# EAGLE schematic CANSniftAndShift (EAGLE 6.6.0)

## Sheet 1 of 3
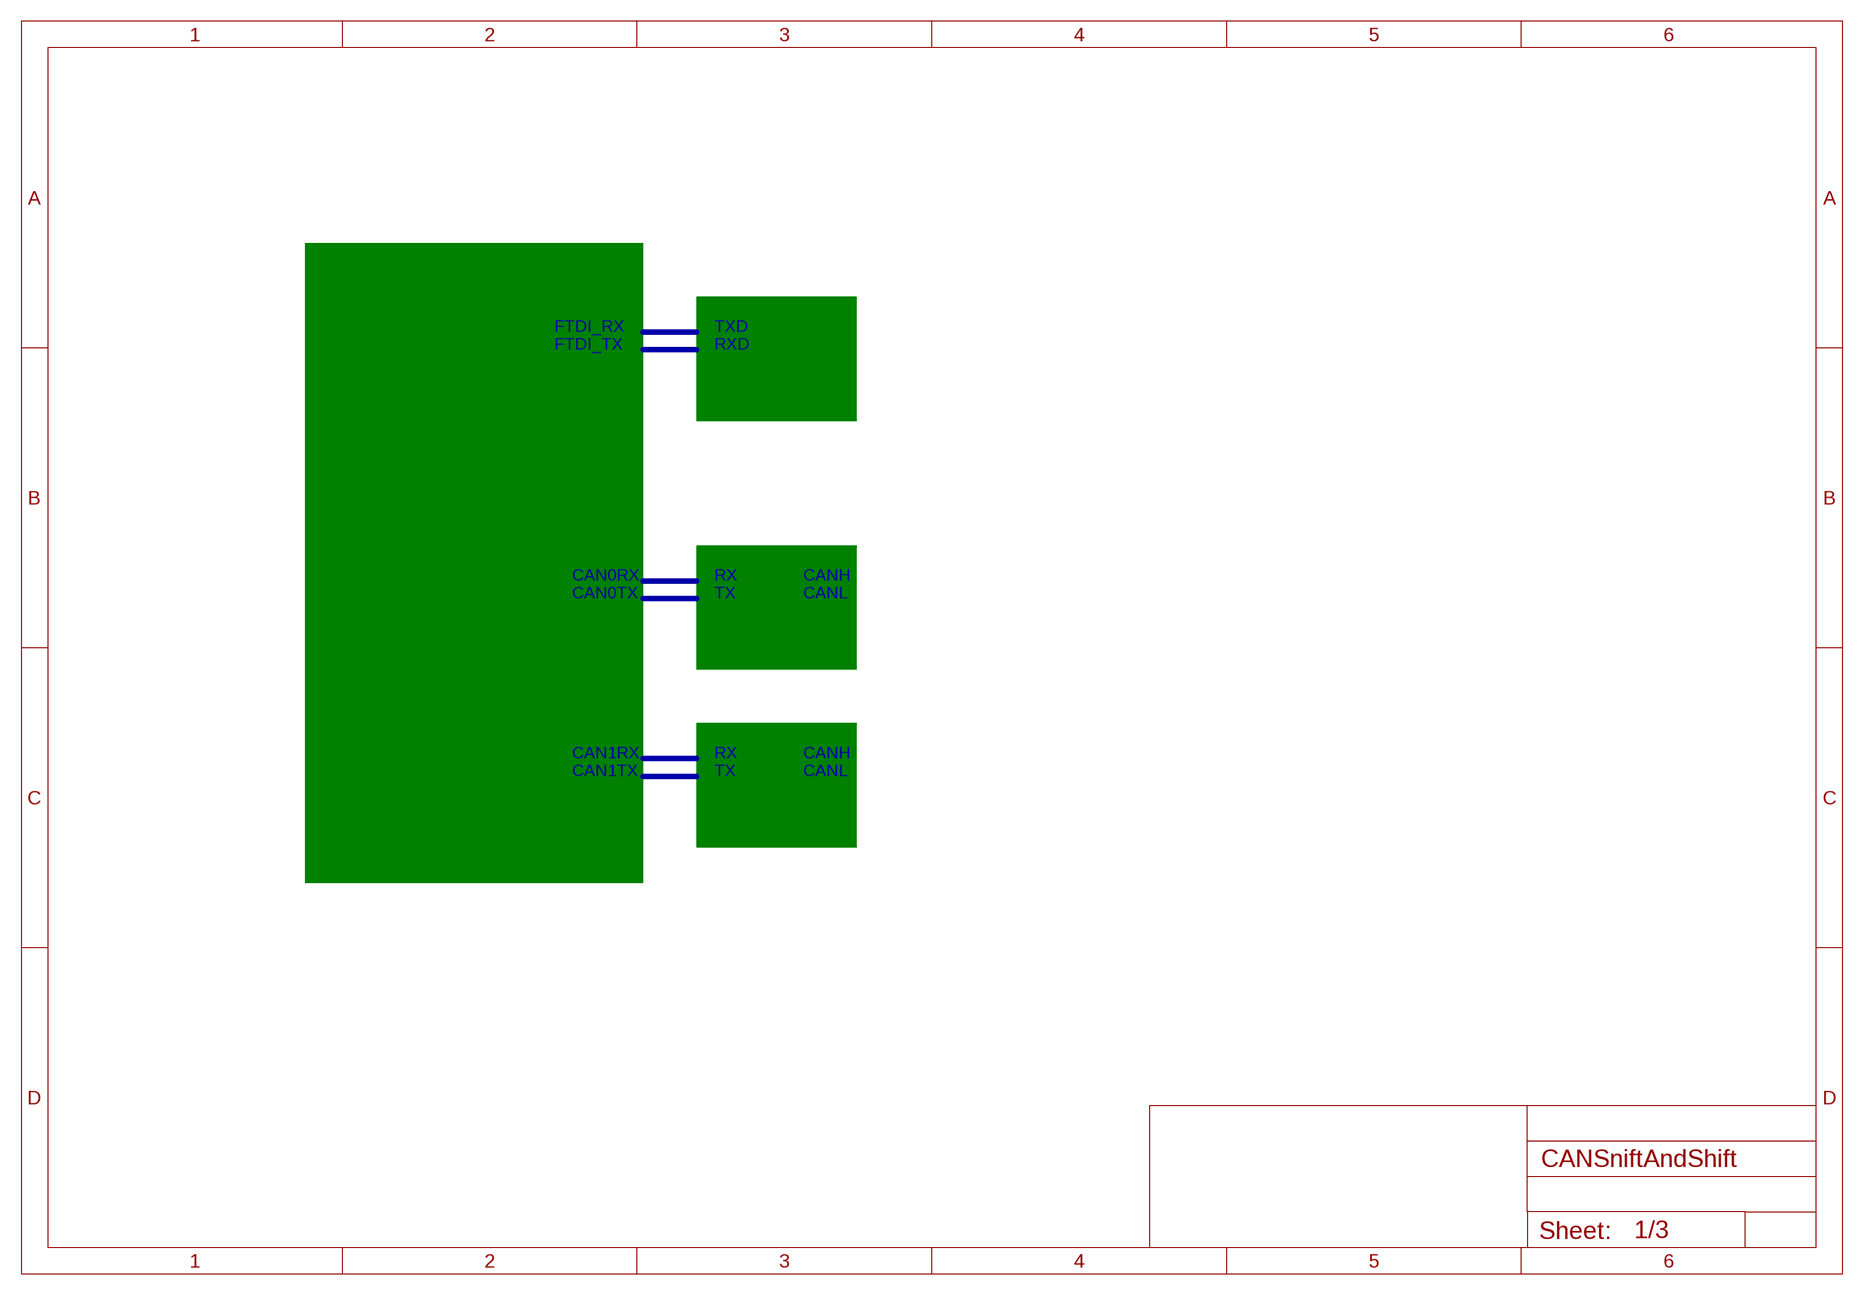
[diagram p0: schematic, sheet 1]

### Buses
B$3
B$4
B$5
B$6
B$1
B$2

### Notes on the sheet
- FTDI_RX | TXD
- FTDI_TX | RXD
- FTDI
- CAN0RX | RX | CANH
- CAN0TX | TX | CANL
- CAN1
- CAN1RX | RX | CANH
- CAN1TX | TX | CANL
- CAN0
- CPU

## Sheet 2 of 3
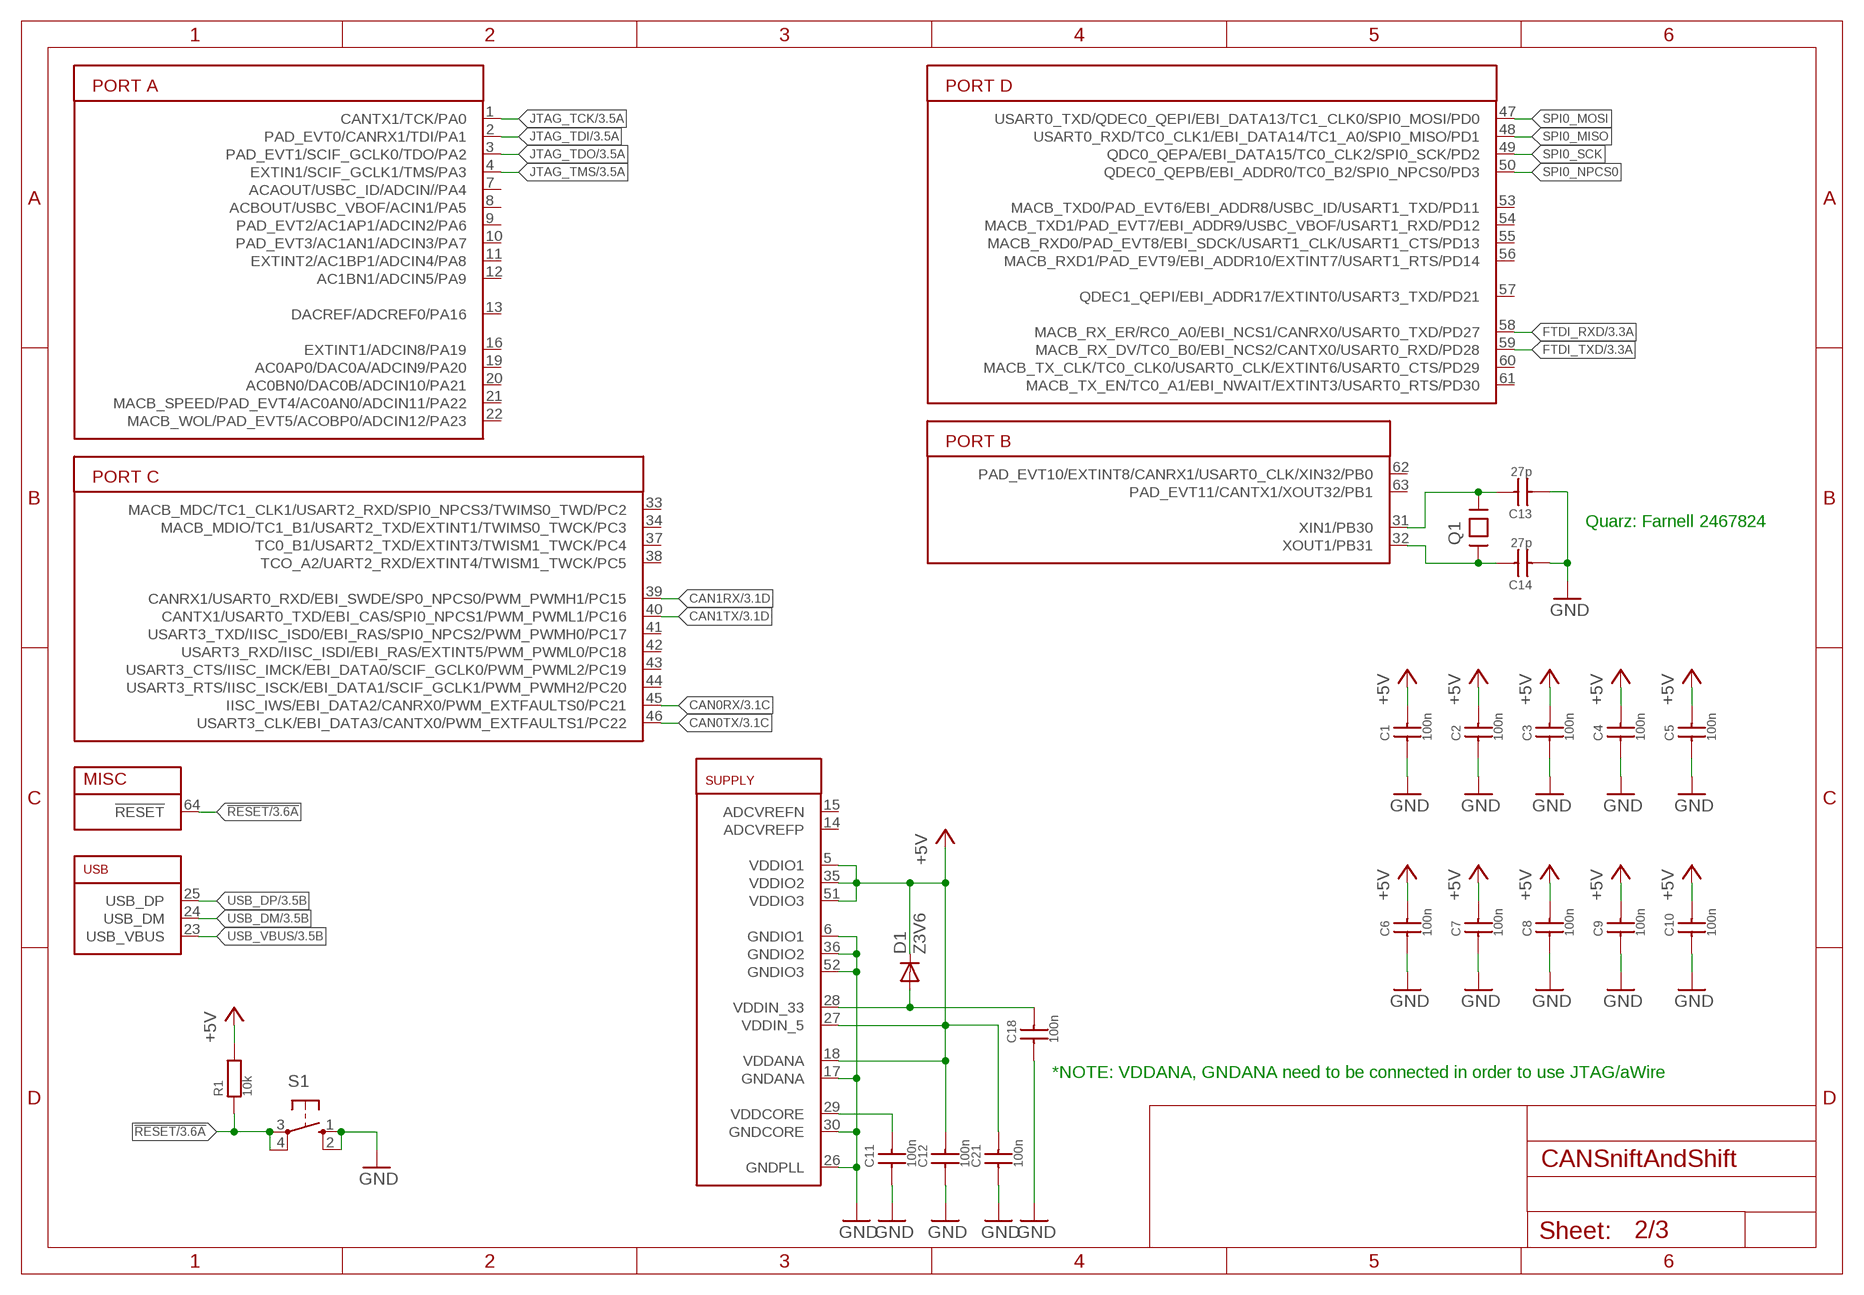
[diagram p1: schematic, sheet 2]

### Parts
C1  100n  C_SMD0603  [C0603]
C2  100n  C_SMD0603  [C0603]
C3  100n  C_SMD0603  [C0603]
C4  100n  C_SMD0603  [C0603]
C5  100n  C_SMD0603  [C0603]
C6  100n  C_SMD0603  [C0603]
C7  100n  C_SMD0603  [C0603]
C8  100n  C_SMD0603  [C0603]
C9  100n  C_SMD0603  [C0603]
C10  100n  C_SMD0603  [C0603]
C11  100n  C_SMD0603  [C0603]
C12  100n  C_SMD0603  [C0603]
C13  27p  C_SMD0603  [C0603]
C14  27p  C_SMD0603  [C0603]
C18  100n  C_SMD0603  [C0603]
C21  100n  C_SMD0603  [C0603]
D1  Z3V6  BZG03C15TR3  [DO214A]
IC1  AT32UC3C264C0.5MM  [TQFP64-0.5MM]
Q1  16MHz  CRYSTAL-ABRACON-ABM7-SMD  [CRYSTAL-ABRACON-ABM7-SMD]
R1  10k  R0603  [R0603]
S1  10-XX  [B3F-10XX]

### Nets
!RESET: IC1.64(!RESET) R1.1 S1.3(P) S1.4(P1) ; also sheet 3
+5V: C1.2 C2.2 C3.2 C4.2 C5.2 C6.2 C7.2 C8.2 C9.2 C10.2 C12.2 C21.2 D1.C IC1.5(VDDIO1) IC1.18(VDDANA) IC1.27(VDDIN_5) IC1.35(VDDIO2) IC1.51(VDDIO3) R1.2 ; also sheet 3
CAN0RX: IC1.45(IISC_IWS/EBI_DATA2/CANRX0/PWM_EXTFAULTS0/PC21) ; also sheet 3
CAN0TX: IC1.46(USART3_CLK/EBI_DATA3/CANTX0/PWM_EXTFAULTS1/PC22) ; also sheet 3
CAN1RX: IC1.39(CANRX1/USART0_RXD/EBI_SWDE/SP0_NPCS0/PWM_PWMH1/PC15) ; also sheet 3
CAN1TX: IC1.40(CANTX1/USART0_TXD/EBI_CAS/SPI0_NPCS1/PWM_PWML1/PC16) ; also sheet 3
FTDI_RXD: IC1.58(MACB_RX_ER/RC0_A0/EBI_NCS1/CANRX0/USART0_TXD/PD27) ; also sheet 3
FTDI_TXD: IC1.59(MACB_RX_DV/TC0_B0/EBI_NCS2/CANTX0/USART0_RXD/PD28) ; also sheet 3
GND: C1.1 C2.1 C3.1 C4.1 C5.1 C6.1 C7.1 C8.1 C9.1 C10.1 C11.1 C12.1 C13.1 C14.1 C18.1 C21.1 IC1.6(GNDIO1) IC1.17(GNDANA) IC1.26(GNDPLL) IC1.30(GNDCORE) IC1.36(GNDIO2) IC1.52(GNDIO3) S1.1(S) S1.2(S1) ; also sheet 3
JTAG_TCK: IC1.1(CANTX1/TCK/PA0) ; also sheet 3
JTAG_TDI: IC1.2(PAD_EVT0/CANRX1/TDI/PA1) ; also sheet 3
JTAG_TDO: IC1.3(PAD_EVT1/SCIF_GCLK0/TDO/PA2) ; also sheet 3
JTAG_TMS: IC1.4(EXTIN1/SCIF_GCLK1/TMS/PA3) ; also sheet 3
N$2: C11.2 IC1.29(VDDCORE)
N$3: C13.2 IC1.31(XIN1/PB30) Q1.P$2
N$4: C14.2 IC1.32(XOUT1/PB31) Q1.P$1
N$8: C18.2 D1.A IC1.28(VDDIN_33)
SPI0_MISO: IC1.48(USART0_RXD/TC0_CLK1/EBI_DATA14/TC1_A0/SPI0_MISO/PD1)
SPI0_MOSI: IC1.47(USART0_TXD/QDEC0_QEPI/EBI_DATA13/TC1_CLK0/SPI0_MOSI/PD0)
SPI0_NPCS0: IC1.50(QDEC0_QEPB/EBI_ADDR0/TC0_B2/SPI0_NPCS0/PD3)
SPI0_SCK: IC1.49(QDC0_QEPA/EBI_DATA15/TC0_CLK2/SPI0_SCK/PD2)
USB_DM: IC1.24(USB_DM) ; also sheet 3
USB_DP: IC1.25(USB_DP) ; also sheet 3
USB_VBUS: IC1.23(USB_VBUS) ; also sheet 3
Unconnected: IC1.7(ACAOUT/USBC_ID/ADCIN//PA4) IC1.8(ACBOUT/USBC_VBOF/ACIN1/PA5) IC1.9(PAD_EVT2/AC1AP1/ADCIN2/PA6) IC1.10(PAD_EVT3/AC1AN1/ADCIN3/PA7) IC1.11(EXTINT2/AC1BP1/ADCIN4/PA8) IC1.12(AC1BN1/ADCIN5/PA9) IC1.13(DACREF/ADCREF0/PA16) IC1.14(ADCVREFP) IC1.15(ADCVREFN) IC1.16(EXTINT1/ADCIN8/PA19) IC1.19(AC0AP0/DAC0A/ADCIN9/PA20) IC1.20(AC0BN0/DAC0B/ADCIN10/PA21) IC1.21(MACB_SPEED/PAD_EVT4/AC0AN0/ADCIN11/PA22) IC1.22(MACB_WOL/PAD_EVT5/ACOBP0/ADCIN12/PA23) IC1.33(MACB_MDC/TC1_CLK1/USART2_RXD/SPI0_NPCS3/TWIMS0_TWD/PC2) IC1.34(MACB_MDIO/TC1_B1/USART2_TXD/EXTINT1/TWIMS0_TWCK/PC3) IC1.37(TC0_B1/USART2_TXD/EXTINT3/TWISM1_TWCK/PC4) IC1.38(TCO_A2/UART2_RXD/EXTINT4/TWISM1_TWCK/PC5) IC1.41(USART3_TXD/IISC_ISD0/EBI_RAS/SPI0_NPCS2/PWM_PWMH0/PC17) IC1.42(USART3_RXD/IISC_ISDI/EBI_RAS/EXTINT5/PWM_PWML0/PC18) IC1.43(USART3_CTS/IISC_IMCK/EBI_DATA0/SCIF_GCLK0/PWM_PWML2/PC19) IC1.44(USART3_RTS/IISC_ISCK/EBI_DATA1/SCIF_GCLK1/PWM_PWMH2/PC20) IC1.53(MACB_TXD0/PAD_EVT6/EBI_ADDR8/USBC_ID/USART1_TXD/PD11) IC1.54(MACB_TXD1/PAD_EVT7/EBI_ADDR9/USBC_VBOF/USART1_RXD/PD12) IC1.55(MACB_RXD0/PAD_EVT8/EBI_SDCK/USART1_CLK/USART1_CTS/PD13) IC1.56(MACB_RXD1/PAD_EVT9/EBI_ADDR10/EXTINT7/USART1_RTS/PD14) IC1.57(QDEC1_QEPI/EBI_ADDR17/EXTINT0/USART3_TXD/PD21) IC1.60(MACB_TX_CLK/TC0_CLK0/USART0_CLK/EXTINT6/USART0_CTS/PD29) IC1.61(MACB_TX_EN/TC0_A1/EBI_NWAIT/EXTINT3/USART0_RTS/PD30) IC1.62(PAD_EVT10/EXTINT8/CANRX1/USART0_CLK/XIN32/PB0) IC1.63(PAD_EVT11/CANTX1/XOUT32/PB1)

### Notes on the sheet
- Quarz: Farnell 2467824
- *NOTE: VDDANA, GNDANA need to be connected in order to use JTAG/aWire

## Sheet 3 of 3
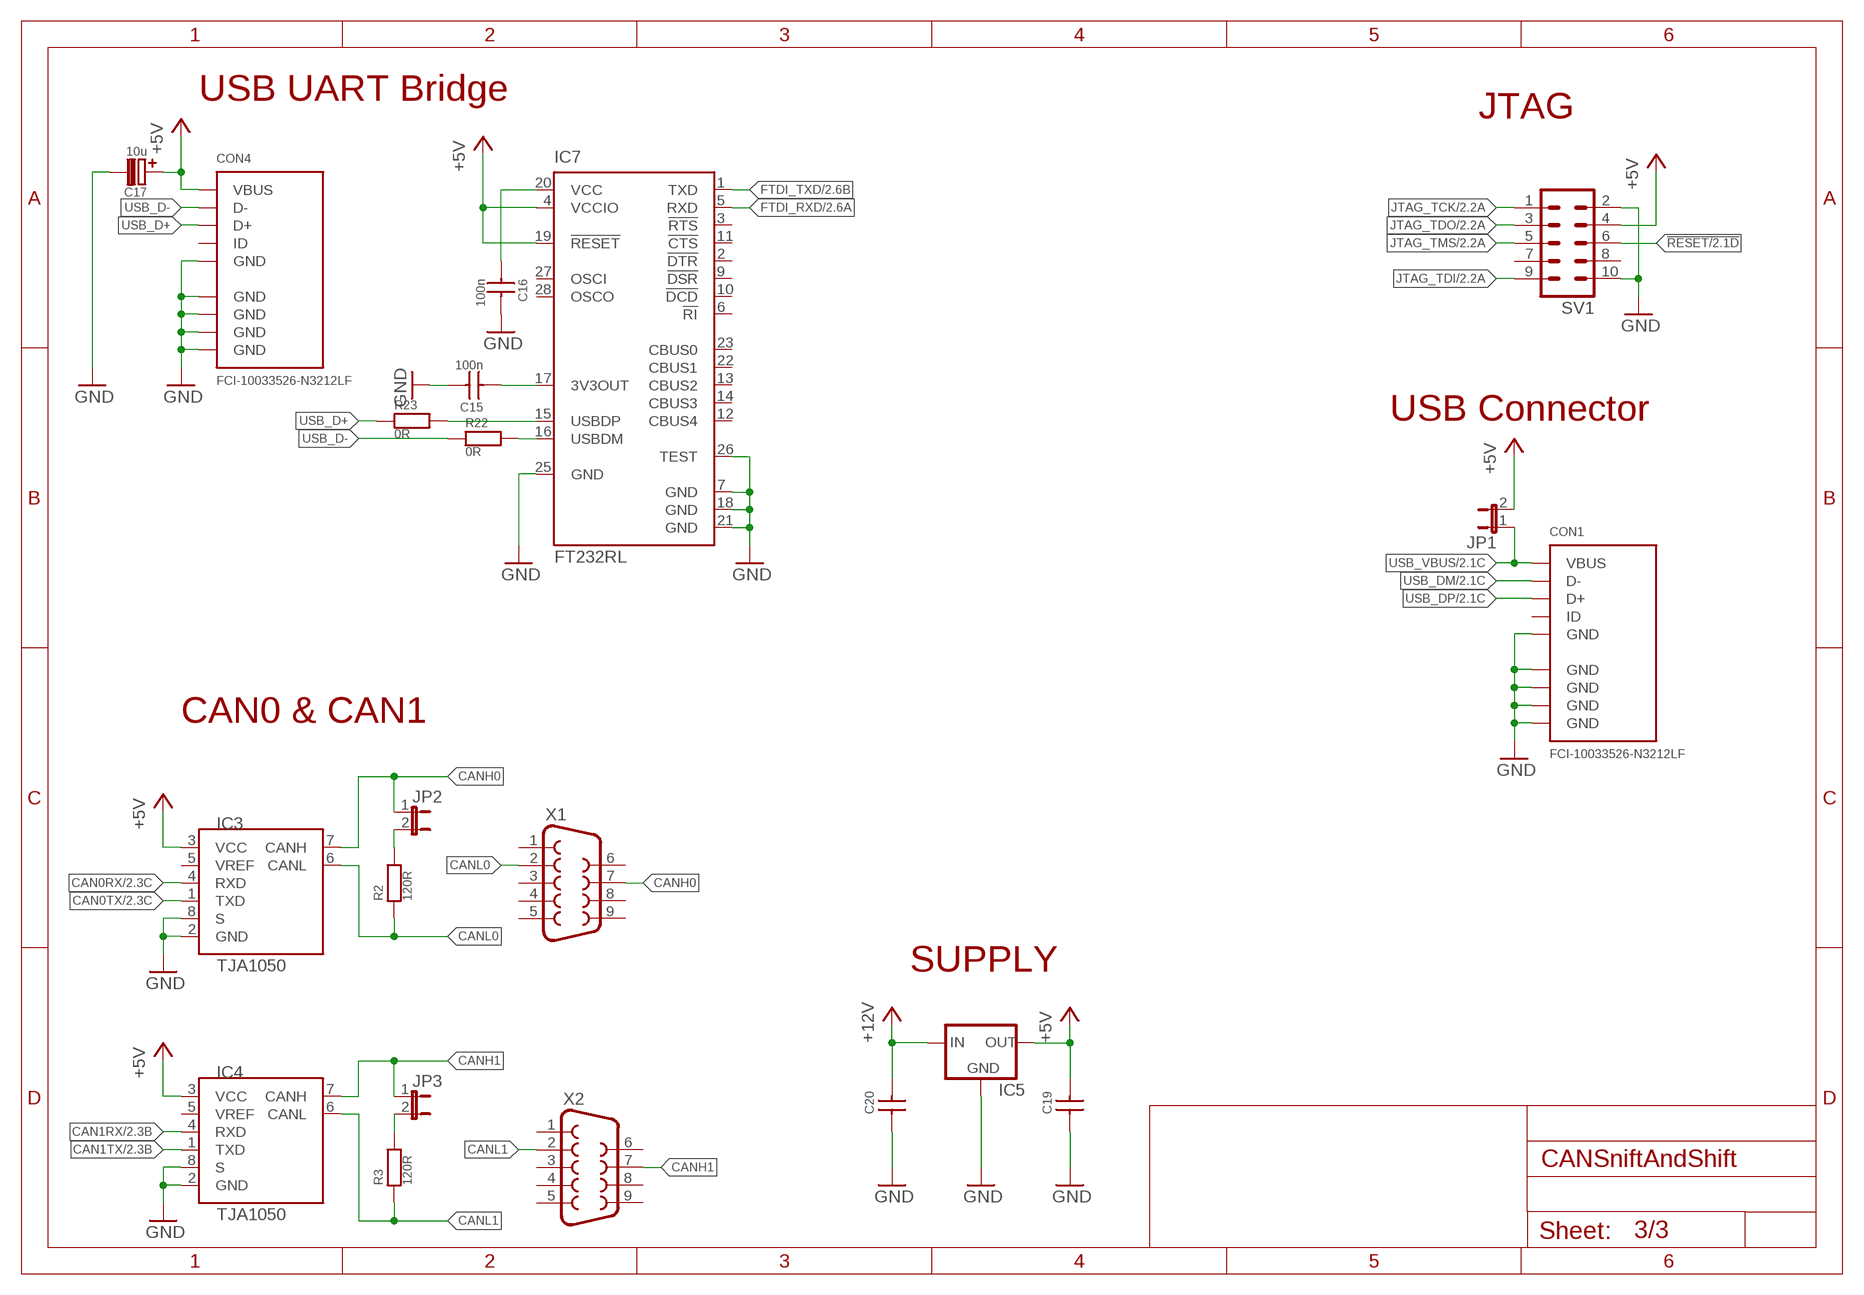
[diagram p2: schematic, sheet 3]

### Parts
C15  100n  C_SMD0402  [C0402]
C16  100n  C_SMD0402  [C0402]
C17  10u  C_POL4X4MM  [C_POL_4X4MM]
C19  C_SMD0603  [C0603]
C20  C_SMD0603  [C0603]
CON1  FCI-10033526-N3212LF  [FCI-10033526-N3212LF]
CON4  FCI-10033526-N3212LF  [FCI-10033526-N3212LF]
IC3  TJA1050  [SO8]
IC4  TJA1050  [SO8]
IC5  78XXL  [78XXL]
IC7  FT232RL  [SSOP28]
JP1  JUMPER2  [JUMPER2_THROUGHHOLE]
JP2  JUMPER2  [JUMPER2_THROUGHHOLE]
JP3  JUMPER2  [JUMPER2_THROUGHHOLE]
R2  120R  R0603  [R0603]
R3  120R  R0603  [R0603]
R22  0R  R0402  [R0402]
R23  0R  R0402  [R0402]
SV1  ML10  [ML10]
X1  F09HP  [F09HP]
X2  F09HP  [F09HP]

### Nets
!RESET: SV1.6 ; also sheet 2
+5V: C17.+ C19.2 CON4.1(VBUS) IC3.3(VCC) IC4.3(VCC) IC5.OUT IC7.4(VCCIO) IC7.19(!RESET) JP1.2 SV1.4 ; also sheet 2
+12V: C20.2 IC5.IN
CAN0RX: IC3.4(RXD) ; also sheet 2
CAN0TX: IC3.1(TXD) ; also sheet 2
CAN1RX: IC4.4(RXD) ; also sheet 2
CAN1TX: IC4.1(TXD) ; also sheet 2
CANH0: IC3.7(CANH) JP2.1 X1.7
CANH1: IC4.7(CANH) JP3.1 X2.7
CANL0: IC3.6(CANL) R2.1 X1.2
CANL1: IC4.6(CANL) R3.1 X2.2
FTDI_3V3OUT: C15.1 IC7.17(3V3OUT)
FTDI_RXD: IC7.5(RXD) ; also sheet 2
FTDI_TXD: IC7.1(TXD) ; also sheet 2
GND: C15.2 C16.2 C17.- C19.1 C20.1 CON1.5(GND) CON1.GND@1(GND) CON1.GND@2(GND) CON1.GND@3(GND) CON1.GND@4(GND) CON4.5(GND) CON4.GND@1(GND) CON4.GND@2(GND) CON4.GND@3(GND) CON4.GND@4(GND) IC3.2(GND) IC3.8(S) IC4.2(GND) IC4.8(S) IC5.GND IC7.7(GND) IC7.18(GND) IC7.21(GND) IC7.25(GND) IC7.26(TEST) SV1.2 SV1.10 ; also sheet 2
JTAG_TCK: SV1.1 ; also sheet 2
JTAG_TDI: SV1.9 ; also sheet 2
JTAG_TDO: SV1.3 ; also sheet 2
JTAG_TMS: SV1.5 ; also sheet 2
N$5: IC7.15(USBDP) R23.2
N$6: IC7.16(USBDM) R22.2
N$7: JP2.2 R2.2
N$9: JP3.2 R3.2
N$12: C16.1 IC7.20(VCC)
USB_D+: CON4.3(D+) R23.1
USB_D-: CON4.2(D-) R22.1
USB_DM: CON1.2(D-) ; also sheet 2
USB_DP: CON1.3(D+) ; also sheet 2
USB_VBUS: CON1.1(VBUS) JP1.1 ; also sheet 2
Unconnected: CON1.4(ID) CON4.4(ID) IC3.5(VREF) IC4.5(VREF) IC7.2(!DTR) IC7.3(!RTS) IC7.6(!RI) IC7.9(!DSR) IC7.10(!DCD) IC7.11(!CTS) IC7.12(CBUS4) IC7.13(CBUS2) IC7.14(CBUS3) IC7.22(CBUS1) IC7.23(CBUS0) IC7.27(OSCI) IC7.28(OSCO) SV1.7 SV1.8 X1.1 X1.3 X1.4 X1.5 X1.6 X1.8 X1.9 X2.1 X2.3 X2.4 X2.5 X2.6 X2.8 X2.9

### Notes on the sheet
- USB UART Bridge
- JTAG
- USB Connector
- CAN0 & CAN1
- SUPPLY

## Library data of the parts
C1-C16 C18-C21 = SchlegelAr_Master:C_SMD: C SMD 0402, 0603, 0805, 1206 last modified: Armin Schlegel, 24.03.2014
C17 = SchlegelAr_Master:C_POL: C Pol last modified: Armin Schlegel, 20.03.2014
CON1 CON4 = SchlegelAr_Master:FCI-10033526-N3212LF: FCI-10033526-N3212LF - USB-Stecker MINIUSB B TYPE RT ANGLE RECEPTACLE last modified: Armin Schlegel, 28.04.2014 http://de.mouser.com/ProductDetail/FCI/10033526-N3212LF/?qs=%2Fha2pyFadujxDEaTCG%2F3IgsbFChSuv66JrkjaCBKgukjCIH%2FH4qAI7ajoEkcwwLO http://portal.fciconnect.com/Comergent//fci/drawing/10033526.pdf
D1 = SchlegelAr_Master:BZG03C15TR3: BZG03C15TR3 - Zener-Dioden 15 Volt 600W 5% last modified: Armin Schlegel, 28.04.2014 http://de.mouser.com/ProductDetail/Vishay-Semiconductors/BZG03C15TR3/?qs=RzxYCzJDjPUsxnwuRFs/Dg== http://www.mouser.com/ds/2/427/bzg03c-89028.pdf
IC1 = AT32UC3C264C:AT32UC3C264C
IC3 IC4 = SchlegelAr_Master:TJA1050
IC5 = v-reg:78XXL: VOLTAGE REGULATOR
IC7 = SchlegelAr_Master:FT232RL: FT232RL - USB-IC-Schnittstelle USB to Serial UART Enhanced IC last modified: Armin Schlegel, 28.04.2014 http://de.mouser.com/ProductDetail/FTDI/FT232RL-REEL/?qs=sGAEpiMZZMs5ceO8zL%252bTxyQLQIH6hE7q http://www.mouser.com/ds/2/163/DS_FT232R-11534.pdf
JP1-JP3 = SchlegelAr_Master:JUMPER2: JUMPER2 - Jumper 2 pol. last modified: Armin Schlegel, 28.04.2014
Q1 = crystal-abracon-abm3-smd:CRYSTAL-ABRACON-ABM7-SMD
R1-R3 R22 R23 = SchlegelAr_Master:R: Widerstaende in 0402, 0603, 0805, 1206, 2512 last modified: Armin Schlegel, 28.04.2014
S1 = switch-omron:10-XX: OMRON SWITCH; MPN: B3F-1000; OC_FARNELL: 176432; OC_NEWARK: 36M3542
SV1 = con-harting-ml:ML10: HARTING; OC_FARNELL: unknown; OC_NEWARK: unknown
X1 X2 = con-subd:F09: SUB-D; OC_FARNELL: unknown; OC_NEWARK: unknown